# EAGLE design RFID_Brd_02 (EAGLE 7.2.0)
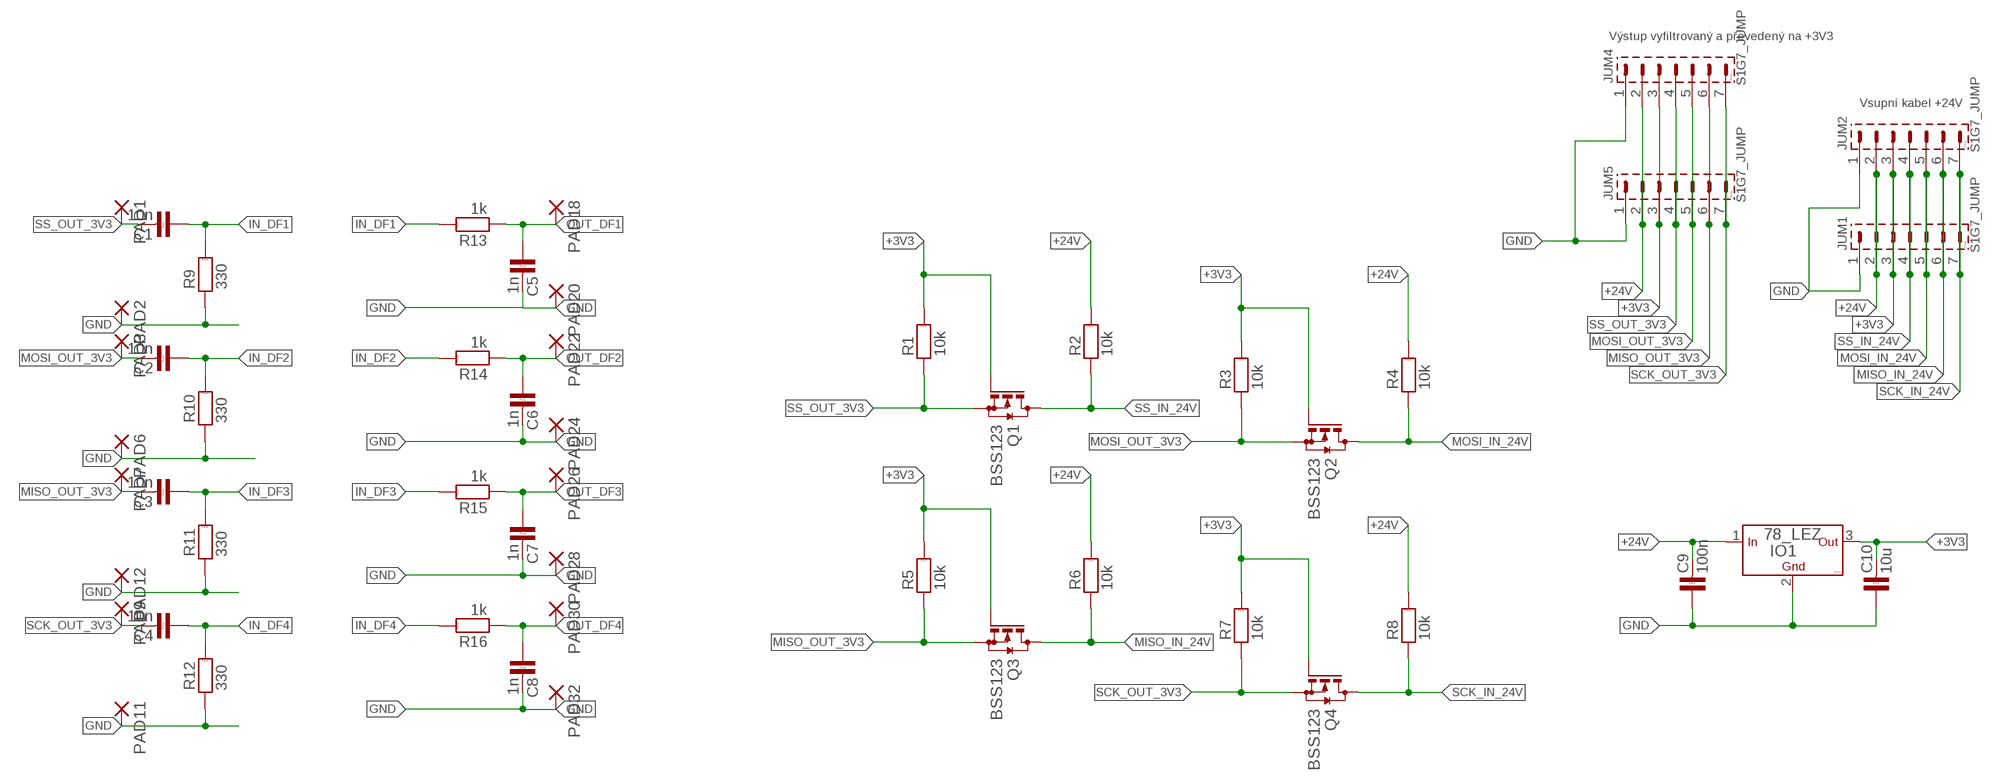
[diagram p0: schematic, sheet 1]

## Parts
C1  10n  C-KER_1206  [1206]
C2  10n  C-KER_1206  [1206]
C3  10n  C-KER_1206  [1206]
C4  10n  C-KER_1206  [1206]
C5  1n  C-KER_1206  [1206]
C6  1n  C-KER_1206  [1206]
C7  1n  C-KER_1206  [1206]
C8  1n  C-KER_1206  [1206]
C9  100n  C-KER_1206  [1206]
C10  10u  C-KER_1206  [1206]
IO1  78_LEZ  [TO-220]
JUM1  S1G7_JUMP  [S1G7_JUM]
JUM2  S1G7_JUMP  [S1G7_JUM]
JUM4  S1G7_JUMP  [S1G7_JUM]
JUM5  S1G7_JUMP  [S1G7_JUM]
PAD1  SMD2  [SMD1,27-2,54]
PAD2  SMD2  [SMD1,27-2,54]
PAD3  SMD2  [SMD1,27-2,54]
PAD6  SMD2  [SMD1,27-2,54]
PAD7  SMD2  [SMD1,27-2,54]
PAD9  SMD2  [SMD1,27-2,54]
PAD11  SMD2  [SMD1,27-2,54]
PAD12  SMD2  [SMD1,27-2,54]
PAD18  SMD2  [SMD1,27-2,54]
PAD20  SMD2  [SMD1,27-2,54]
PAD22  SMD2  [SMD1,27-2,54]
PAD24  SMD2  [SMD1,27-2,54]
PAD26  SMD2  [SMD1,27-2,54]
PAD28  SMD2  [SMD1,27-2,54]
PAD30  SMD2  [SMD1,27-2,54]
PAD32  SMD2  [SMD1,27-2,54]
Q1  BSS123  [SOT23]
Q2  BSS123  [SOT23]
Q3  BSS123  [SOT23]
Q4  BSS123  [SOT23]
R1  10k  R_1206  [1206]
R2  10k  R_1206  [1206]
R3  10k  R_1206  [1206]
R4  10k  R_1206  [1206]
R5  10k  R_1206  [1206]
R6  10k  R_1206  [1206]
R7  10k  R_1206  [1206]
R8  10k  R_1206  [1206]
R9  330  R_1206  [1206]
R10  330  R_1206  [1206]
R11  330  R_1206  [1206]
R12  330  R_1206  [1206]
R13  1k  R_1206  [1206]
R14  1k  R_1206  [1206]
R15  1k  R_1206  [1206]
R16  1k  R_1206  [1206]

## Nets
+3V3: C10.2 IO1.3(OUT) JUM1.3 JUM2.3 JUM4.3 JUM5.3 Q1.1(G) Q2.1(G) Q3.1(G) Q4.1(G) R1.2 R3.2 R5.2 R7.2
+24V: C9.2 IO1.1(IN) JUM1.2 JUM2.2 JUM4.2 JUM5.2 R2.2 R4.2 R6.2 R8.2
GND: C5.2 C6.2 C7.2 C8.2 C9.1 C10.1 IO1.2(GND) JUM1.1 JUM2.1 JUM4.1 JUM5.1 PAD2.1(P) PAD6.1(P) PAD11.1(P) PAD12.1(P) PAD20.1(P) PAD24.1(P) PAD28.1(P) PAD32.1(P) R9.1 R10.1 R11.1 R12.1
IN_DF1: C1.1 R9.2 R13.2
IN_DF2: C2.1 R10.2 R14.2
IN_DF3: C3.1 R11.2 R15.2
IN_DF4: C4.1 R12.2 R16.2
MISO_IN_24V: JUM1.6 JUM2.6 Q3.3(D) R6.1
MISO_OUT_3V3: C3.2 JUM4.6 JUM5.6 PAD7.1(P) Q3.2(S) R5.1
MOSI_IN_24V: JUM1.5 JUM2.5 Q2.3(D) R4.1
MOSI_OUT_3V3: C2.2 JUM4.5 JUM5.5 PAD3.1(P) Q2.2(S) R3.1
OUT_DF1: C5.1 PAD18.1(P) R13.1
OUT_DF2: C6.1 PAD22.1(P) R14.1
OUT_DF3: C7.1 PAD26.1(P) R15.1
OUT_DF4: C8.1 PAD30.1(P) R16.1
SCK_IN_24V: JUM1.7 JUM2.7 Q4.3(D) R8.1
SCK_OUT_3V3: C4.2 JUM4.7 JUM5.7 PAD9.1(P) Q4.2(S) R7.1
SS_IN_24V: JUM1.4 JUM2.4 Q1.3(D) R2.1
SS_OUT_3V3: C1.2 JUM4.4 JUM5.4 PAD1.1(P) Q1.2(S) R1.1

## Notes on the sheet
- Výstup vyfiltrovaný a převedený na +3V3
- Vsupní kabel +24V

## Library data of the parts
C1-C10 = #PaJa_31:C-KER: Kondenzator - keramicky
IO1 = #PaJa_31:78?: Stabilizator - 1A a 1,5A ? - napeti => 05, 06, 08, 09, 12, 15, 18, 20, 24 => 1,5A ? - napeti => 10, 12, 15, 18 => 1A S ? - napeti => 05, 09, 10, 12, 15, 18, 24 => 2A T ? - napeti => 05 => 3A ------------------------------------------------------- Stabilizator - 100mA (TO-92 , SOT-89) ? - napeti => 02, 05, 06, 08, 09, 12, 15, 18
JUM1 JUM2 JUM4 JUM5 = #PaJa_konektory:S1G7_JUMP: Radove konektory - koliky - 7x
PAD1-PAD3 PAD6 PAD7 PAD9 PAD11 PAD12 PAD18 PAD20 PAD22 PAD24 PAD26 PAD28 PAD30 PAD32 = wirepad:SMD2: SMD PAD
Q1-Q4 = transistor-small-signal:BSS123: N-CHANNEL MOS FET
R1-R16 = #PaJa_31:R: Rezistor

## Board
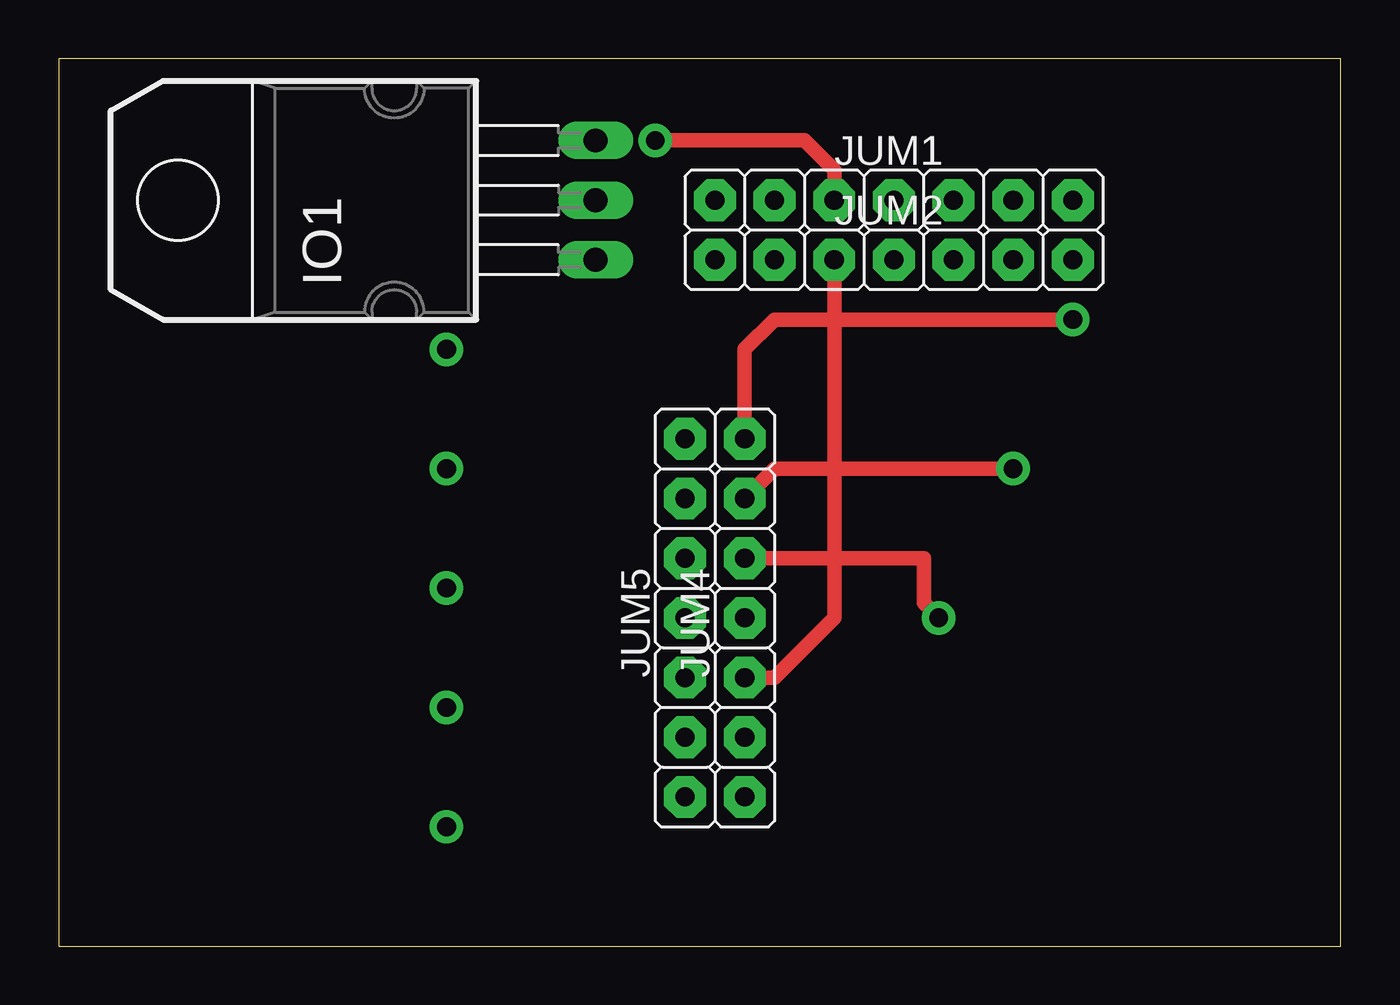
[diagram p1: board, top side]
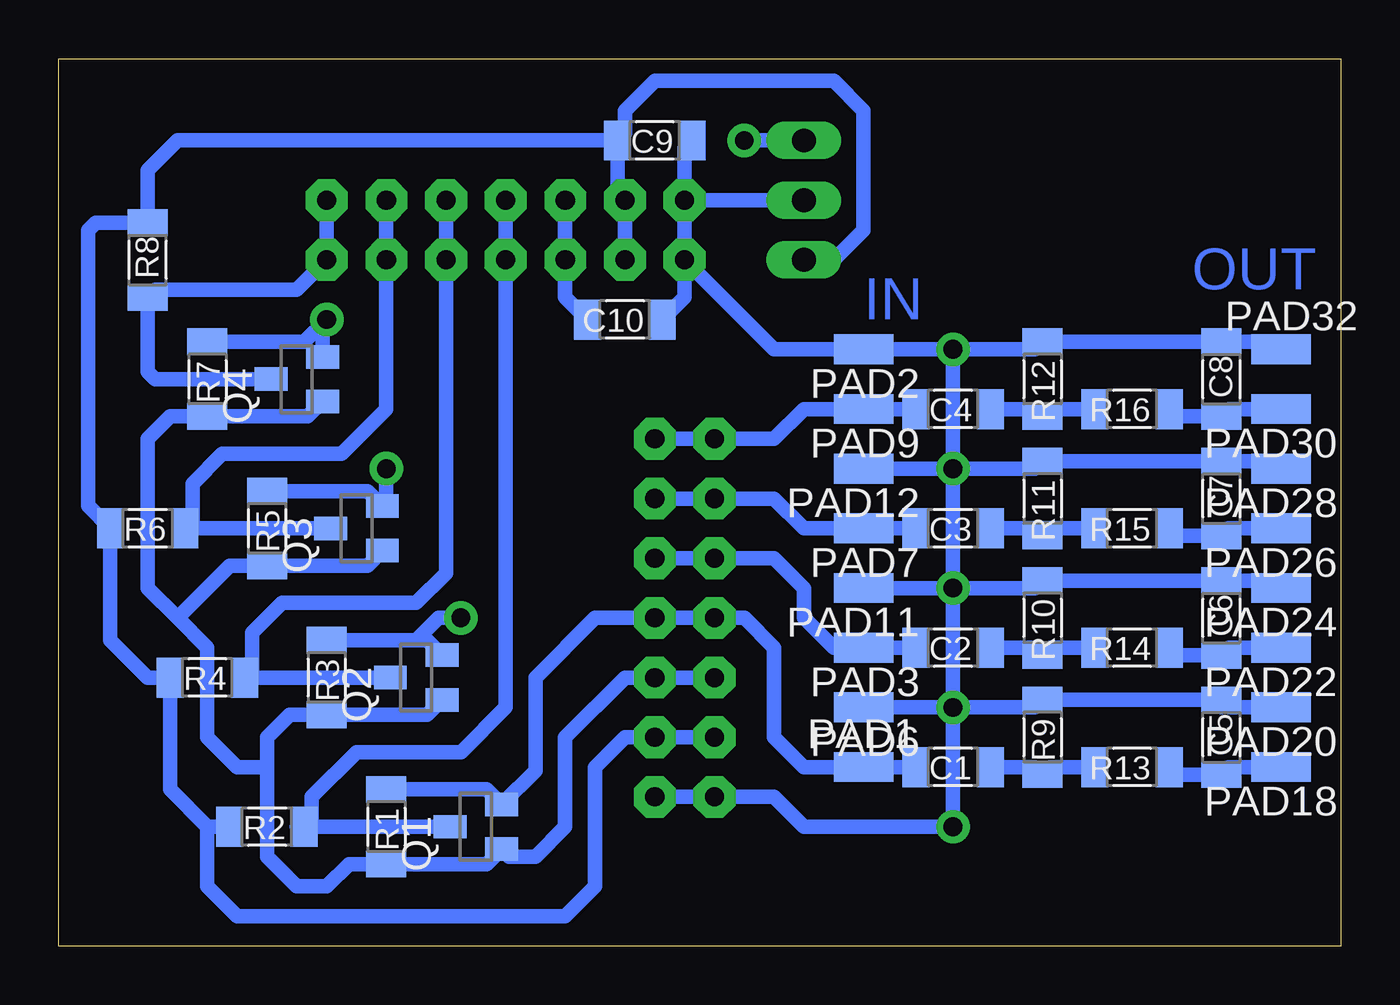
[diagram p2: board, bottom side, seen from below]

Size 54.59 x 37.77 mm. Coordinates in mm from the lower left corner, seen from the top.
Outline: 0,0 22.86,0 54.59,0 54.59,37.77 0,37.77 0,0
Copper layers (1*16): Top 0.035mm / dielectric 1.5mm / Bottom 0.035mm
Design rules "default": minimum track width 10mil, minimum drill 24mil, track to track 8mil, track to pad 8mil, pad to pad 8mil, via to via 8mil, smd to smd 8mil, copper to edge 40mil, drill to drill 8mil, minimum pad ring 10mil, minimum via ring 8mil, stop-mask expansion 4mil, vias tented up to drill 0mil, thermal gap 10mil

### Footprints (pad centres in the part's own frame; a part is rotated, then mirrored left to right if it is on the bottom)
1206 = smd 1.143 x 1.702: 1 -1.587,0; 2 1.587,0
TO-220 = drill 1.016 pad 1.6 long: 1 -2.54,0; 2 0,0; 3 2.54,0
S1G7_JUM = drill 0.813 pad 1.778 octagon: 1 -7.62,0; 2 -5.08,0; 3 -2.54,0; 4 0,0; 5 2.54,0; 6 5.08,0; 7 7.62,0
SMD1,27-2,54 = smd 1.27 x 2.54: 1 0,0
SOT23 = smd 1 x 1.4: 1 -0.95,-1.1; 2 0.95,-1.1; 3 0,1.1

### Placement (x,y rotation side)
C1  16.51,7.62 180 bottom
C2  16.51,12.7 180 bottom
C3  16.51,17.78 180 bottom
C4  16.51,22.86 180 bottom
C5  5.08,8.89 90 bottom
C6  5.08,13.97 90 bottom
C7  5.08,19.05 90 bottom
C8  5.08,24.13 90 bottom
C9  29.21,34.29 180 bottom
C10  30.48,26.67 180 bottom
IO1  22.86,31.75 90 top
JUM1  35.56,31.75 0 top
JUM2  35.56,29.21 0 top
JUM4  29.21,13.97 90 top
JUM5  26.67,13.97 90 top
PAD1  20.32,7.62 270 bottom
PAD2  20.32,25.4 90 bottom
PAD3  20.32,12.7 90 bottom
PAD6  20.32,10.16 90 bottom
PAD7  20.32,17.78 90 bottom
PAD9  20.32,22.86 90 bottom
PAD11  20.32,15.24 90 bottom
PAD12  20.32,20.32 90 bottom
PAD18  2.54,7.62 90 bottom
PAD20  2.54,10.16 90 bottom
PAD22  2.54,12.7 90 bottom
PAD24  2.54,15.24 90 bottom
PAD26  2.54,17.78 90 bottom
PAD28  2.54,20.32 90 bottom
PAD30  2.54,22.86 90 bottom
PAD32  2.54,25.4 270 bottom
Q1  36.83,5.08 90 bottom
Q2  39.37,11.43 90 bottom
Q3  41.91,17.78 90 bottom
Q4  44.45,24.13 90 bottom
R1  40.64,5.08 270 bottom
R2  45.72,5.08 180 bottom
R3  43.18,11.43 270 bottom
R4  48.26,11.43 180 bottom
R5  45.72,17.78 270 bottom
R6  50.8,17.78 180 bottom
R7  48.26,24.13 270 bottom
R8  50.8,29.21 90 bottom
R9  12.7,8.89 270 bottom
R10  12.7,13.97 270 bottom
R11  12.7,19.05 270 bottom
R12  12.7,24.13 270 bottom
R13  8.89,7.62 180 bottom
R14  8.89,12.7 180 bottom
R15  8.89,17.78 180 bottom
R16  8.89,22.86 180 bottom

### Tracks (layer width: path | path; a pad name or v marks a point on that pad's centre or on a via)
+3V3  (via drill 0.8 pad 1.42)
  Top 0.61: JUM4.3 30.48,11.43 33.02,13.97 JUM2.3 | v25.4,34.29 31.75,34.29 33.02,33.02 JUM1.3
  Bottom 0.61: Q4.1 43.99,22.54 R7.2 49.85,22.54 50.8,21.59 50.8,15.24 49.53,13.97 | Q3.1 41.45,16.19 R5.2 47.31,16.19 49.53,13.97 | 45.72,7.62 46.99,7.62 48.26,8.89 48.26,12.7 49.53,13.97 | 45.72,7.62 45.72,3.81 44.45,2.54 43.18,2.54 42.23,3.49 R1.2 36.37,3.49 Q1.1 35.41,3.81 34.29,3.81 33.02,5.08 33.02,8.89 30.48,11.43 JUM4.3 JUM5.3 | 45.72,7.62 45.72,8.89 44.77,9.84 R3.2 38.91,9.84 Q2.1 | JUM1.3 JUM2.3 33.02,27.62 C10.2 | IO1.3 v25.4,34.29
+24V
  Bottom 0.61: 48.26,5.08 49.85,6.67 R4.2 50.8,11.43 52.39,13.02 R6.2 53.34,18.73 53.34,30.48 53.02,30.8 R8.2 50.8,33.02 49.53,34.29 C9.2 | 48.26,5.08 R2.2 | 48.26,5.08 48.26,2.54 46.99,1.27 33.02,1.27 31.75,2.54 31.75,7.62 30.48,8.89 JUM4.2 JUM5.2 | JUM2.2 JUM1.2 30.8,32.07 C9.2 | IO1.1 21.59,29.21 20.32,30.48 20.32,35.56 21.59,36.83 29.21,36.83 30.48,35.56 30.48,34.61 C9.2
GND  (via drill 0.8 pad 1.42)
  Bottom 0.61: PAD20.1 4.76,10.16 C5.2 5.08,10.16 5.4,10.48 R9.1 13.02,10.16 v16.51,10.16 | PAD28.1 2.86,20.64 C7.2 R11.1 13.02,20.32 v16.51,20.32 | PAD32.1 2.86,25.72 C8.2 R12.1 13.02,25.4 v16.51,25.4 | v16.51,25.4 PAD2.1 24.13,25.4 JUM2.1 | PAD12.1 v16.51,20.32 | PAD11.1 v16.51,15.24 | v16.51,15.24 13.02,15.24 R10.1 C6.2 2.86,15.56 PAD24.1 | PAD6.1 v16.51,10.16 | JUM4.1 JUM5.1 24.13,6.35 22.86,5.08 v16.51,5.08 v16.51,10.16 | JUM1.1 JUM2.1 | v16.51,25.4 v16.51,20.32 | v16.51,20.32 v16.51,15.24 | v16.51,15.24 v16.51,10.16 | IO1.2 JUM1.1 | JUM1.1 27.94,33.97 C9.1 | JUM2.1 27.94,27.62 C10.1
IN_DF1
  Bottom 0.61: C1.1 13.02,7.62 R9.2 12.38,7.62 R13.2
IN_DF2
  Bottom 0.61: R14.2 12.38,12.7 R10.2 13.02,12.7 C2.1
IN_DF3
  Bottom 0.61: C3.1 13.02,17.78 R11.2 12.7,17.78 R15.2
IN_DF4
  Bottom 0.61: C4.1 13.02,22.86 R12.2 12.38,22.86 R16.2
MISO_IN_24V
  Bottom 0.61: Q3.3 R6.1 48.89,18.1 48.89,19.68 47.62,20.95 42.55,20.95 40.64,22.86 JUM2.6 JUM1.6
MISO_OUT_3V3  (via drill 0.8 pad 1.42)
  Top 0.61: JUM4.6 30.48,20.32 v40.64,20.32
  Bottom 0.61: R5.1 41.45,19.37 Q3.2 40.64,18.9 v40.64,20.32 | JUM4.6 JUM5.6 24.13,19.05 22.86,17.78 PAD7.1 C3.2
MOSI_IN_24V
  Bottom 0.61: Q2.3 R4.1 46.36,11.75 46.36,13.34 45.09,14.61 39.37,14.61 38.1,15.88 JUM2.5 JUM1.5
MOSI_OUT_3V3  (via drill 0.8 pad 1.42)
  Top 0.61: v37.47,13.97 36.83,14.61 36.83,16.51 JUM4.5
  Bottom 0.61: v37.47,13.97 38.42,13.97 39.37,13.02 | JUM4.5 JUM5.5 24.13,16.51 22.86,15.24 22.86,13.97 21.59,12.7 PAD3.1 C2.2 | 39.37,13.02 38.91,13.02 Q2.2 | 39.37,13.02 R3.1
OUT_DF1
  Bottom 0.61: PAD18.1 4.76,7.62 C5.1 6.98,7.3 R13.1
OUT_DF2
  Bottom 0.61: PAD22.1 4.76,12.7 C6.1 6.98,12.38 R14.1
OUT_DF3
  Bottom 0.61: PAD26.1 4.76,17.78 C7.1 6.98,17.46 R15.1
OUT_DF4
  Bottom 0.61: PAD30.1 4.76,22.86 C8.1 6.98,22.54 R16.1
SCK_IN_24V
  Bottom 0.61: Q4.3 50.48,24.13 50.8,24.45 R8.1 50.48,27.94 44.45,27.94 JUM2.7 JUM1.7
SCK_OUT_3V3  (via drill 0.8 pad 1.42)
  Top 0.61: JUM4.7 29.21,25.4 30.48,26.67 v43.18,26.67
  Bottom 0.61: JUM4.7 JUM5.7 24.13,21.59 22.86,22.86 PAD9.1 C4.2 | Q4.2 43.35,26.5 v43.18,26.67 44.13,25.72 R7.1
SS_IN_24V
  Bottom 0.61: Q1.3 R2.1 | JUM1.4 JUM2.4 35.56,10.16 37.47,8.26 41.91,8.26 43.81,6.35 43.81,5.4 R2.1 | 44.45,5.08 R2.1
SS_OUT_3V3
  Bottom 0.61: C1.2 PAD1.1 22.86,7.62 24.13,8.89 24.13,12.7 25.4,13.97 JUM5.4 JUM4.4 31.75,13.97 34.29,11.43 34.29,7.47 Q1.2 36.37,6.67 R1.1

### Text on the board
Bottom: OUT | IN